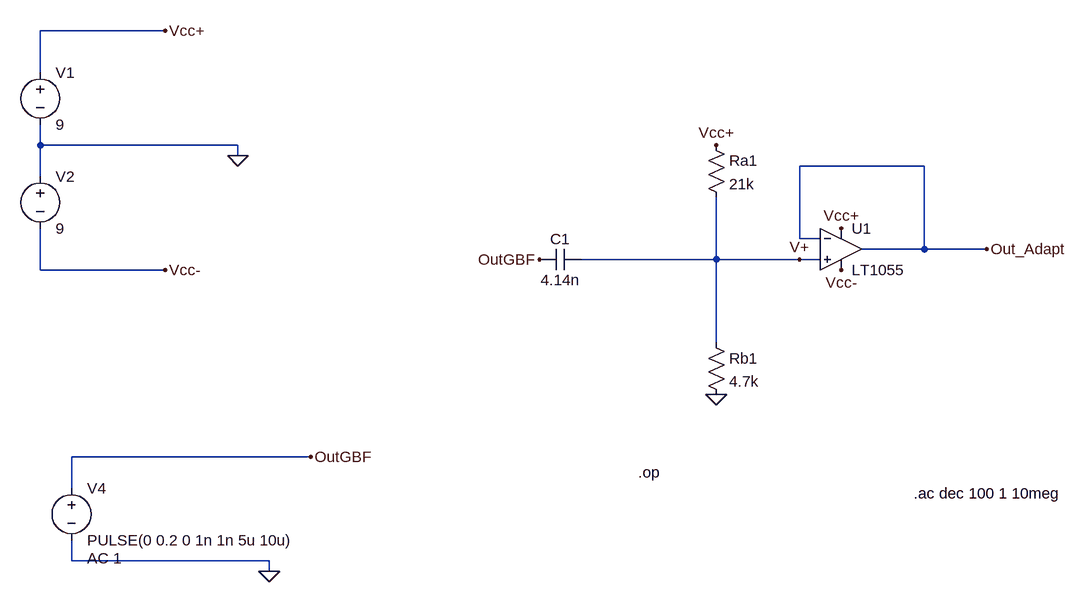
[diagram p0: schematic adaptateur_adc_seul.asc]
adaptateur_adc_seul.asc, the LTspice schematic file:
Version 4
SHEET 1 880 708
WIRE -752 -144 -944 -144
WIRE -944 -80 -944 -144
WIRE -944 32 -944 0
WIRE -640 32 -944 32
WIRE -640 48 -640 32
WIRE 416 64 224 64
WIRE -944 80 -944 32
WIRE 224 176 224 64
WIRE 256 176 224 176
WIRE 416 192 416 64
WIRE 416 192 320 192
WIRE 512 192 416 192
WIRE 96 208 96 112
WIRE 96 208 -112 208
WIRE 224 208 96 208
WIRE 256 208 224 208
WIRE -944 224 -944 160
WIRE -752 224 -944 224
WIRE 96 336 96 208
WIRE -528 512 -896 512
WIRE -896 560 -896 512
WIRE -896 672 -896 640
WIRE -592 672 -896 672
WIRE -592 688 -592 672
FLAG 512 192 Out_Adapt
FLAG 288 160 Vcc+
FLAG 288 224 Vcc-
FLAG 96 416 0
FLAG 96 32 Vcc+
FLAG -640 48 0
FLAG -752 -144 Vcc+
FLAG -752 224 Vcc-
FLAG -592 688 0
FLAG -528 512 OutGBF
FLAG -176 208 OutGBF
FLAG 224 208 V+
SYMBOL cap -112 192 R90
WINDOW 0 0 32 VBottom 2
WINDOW 3 32 32 VTop 2
SYMATTR InstName C1
SYMATTR Value 4.14n
SYMBOL res 80 16 R0
SYMATTR InstName Ra1
SYMATTR Value 21k
SYMBOL res 80 320 R0
SYMATTR InstName Rb1
SYMATTR Value 4.7k
SYMBOL OpAmps\\LT1055 288 128 R0
SYMATTR InstName U1
SYMBOL voltage -944 -96 R0
WINDOW 123 0 0 Left 0
WINDOW 39 0 0 Left 0
SYMATTR InstName V1
SYMATTR Value 9
SYMBOL voltage -944 64 R0
WINDOW 123 0 0 Left 0
WINDOW 39 0 0 Left 0
SYMATTR InstName V2
SYMATTR Value 9
SYMBOL voltage -896 544 R0
WINDOW 123 24 124 Left 2
WINDOW 39 0 0 Left 0
SYMATTR Value2 AC 1
SYMATTR InstName V4
SYMATTR Value PULSE(0 0.2 0 1n 1n 5u 10u)
TEXT 400 568 Left 2 !.ac dec 100 1 10meg
TEXT -24 536 Left 2 !.op

The netlist it stands for:
* adaptateur_adc_seul.asc
C1 V+ OutGBF 4.14n
Ra1 Vcc+ V+ 21k
Rb1 V+ 0 4.7k
XU1 V+ Out_Adapt Vcc+ Vcc- Out_Adapt LT1055  ; pins In+ In- V+ V- OUT
V1 Vcc+ 0 9
V2 0 Vcc- 9
V4 OutGBF 0 PULSE(0 0.2 0 1n 1n 5u 10u) AC 1
.ac dec 100 1 10meg
.op
.backanno
.end

* Results of the author's LTspice run, read from the files saved beside the schematic
* Operating Point, zero values left out:
*   V(v+) = 1.646 V
*   V(vcc+) = 9 V
*   V(out_adapt) = 1.646 V
*   V(vcc-) = -9 V
*   I(Rb1) = 350.2 µA
*   I(Ra1) = 350.2 µA
*   I(V2) = -2.8 mA
*   I(V1) = -3.15 mA
*   Ix(u1:3) = 2.8 mA
*   Ix(u1:4) = -2.8 mA
*   Ix(u1:5) = -4.115 pA
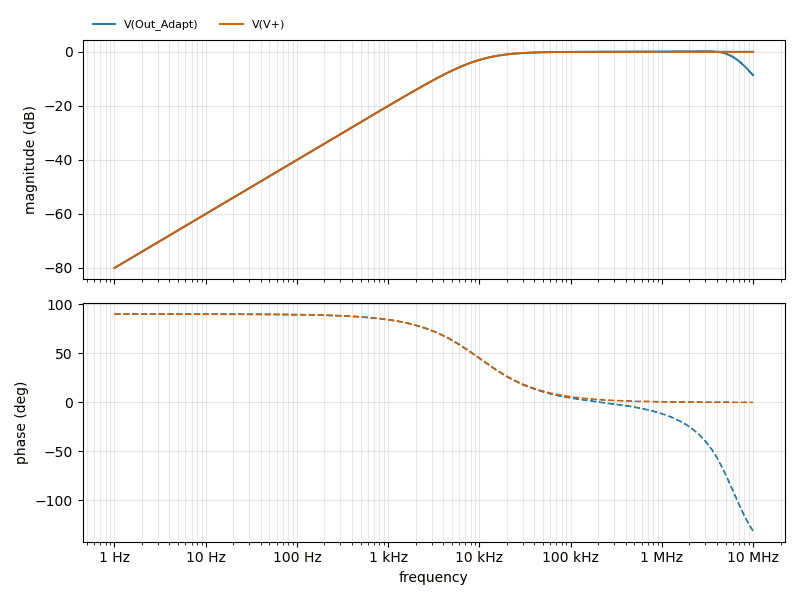
[diagram p1: AC Analysis of adaptateur_adc_seul.asc, plotted from the saved traces]
* AC Analysis, 1 run:
*   V(Out_Adapt): -80.01 dB at 1 Hz, -8.68 dB at 10 MHz, peak 0.21 dB at 2.818 MHz, 3 dB below the peak at 10.53 kHz and 6.59 MHz
*   V(V+): -80.01 dB at 1 Hz, -0.01 dB at 10 MHz, peak -0.01 dB at 10 MHz, 3 dB below the peak at 10 kHz
* From the log:
*   Semiconductor Device Operating Points:
*                           --- Diodes ---
*   Name:    d:u1:3      d:u1:6      d:u1:5      d:u1:4      d:u1:1
*   Model:    u1:dc       u1:y        u1:y        u1:x        u1:x
*   Id:      1.00e-04   -2.06e-22    2.06e-22   -1.06e-10   -7.35e-11
*   Vd:      1.80e+01   -2.06e-10    2.06e-10   -1.06e+01   -7.35e+00
*   Req:     1.00e-02    1.00e-12    1.00e-12    1.00e-11    1.00e-11
*   CAP:     0.00e+00    0.00e+00    0.00e+00    0.00e+00    0.00e+00
*                           --- VDMOSFET Transistors ---
*   Name:        m:u1:2      m:u1:1
*   Model:        u1:p        u1:n
*   Id:         -2.70e-03    2.70e-03
*   Vgs:         2.06e-10    2.06e-10
*   Vds:        -1.06e+01    7.35e+00
*   Vth:         3.00e-01   -3.00e-01
*   Gm:          1.80e-02    1.80e-02
*   Gds:         0.00e+00    0.00e+00
*   Cgs:         0.00e+00    0.00e+00
*   Cgd:         0.00e+00    0.00e+00
*   Cbody:       0.00e+00    0.00e+00